# EAGLE design Fireball_v5.2_AB5SS (EAGLE 7.5.0)
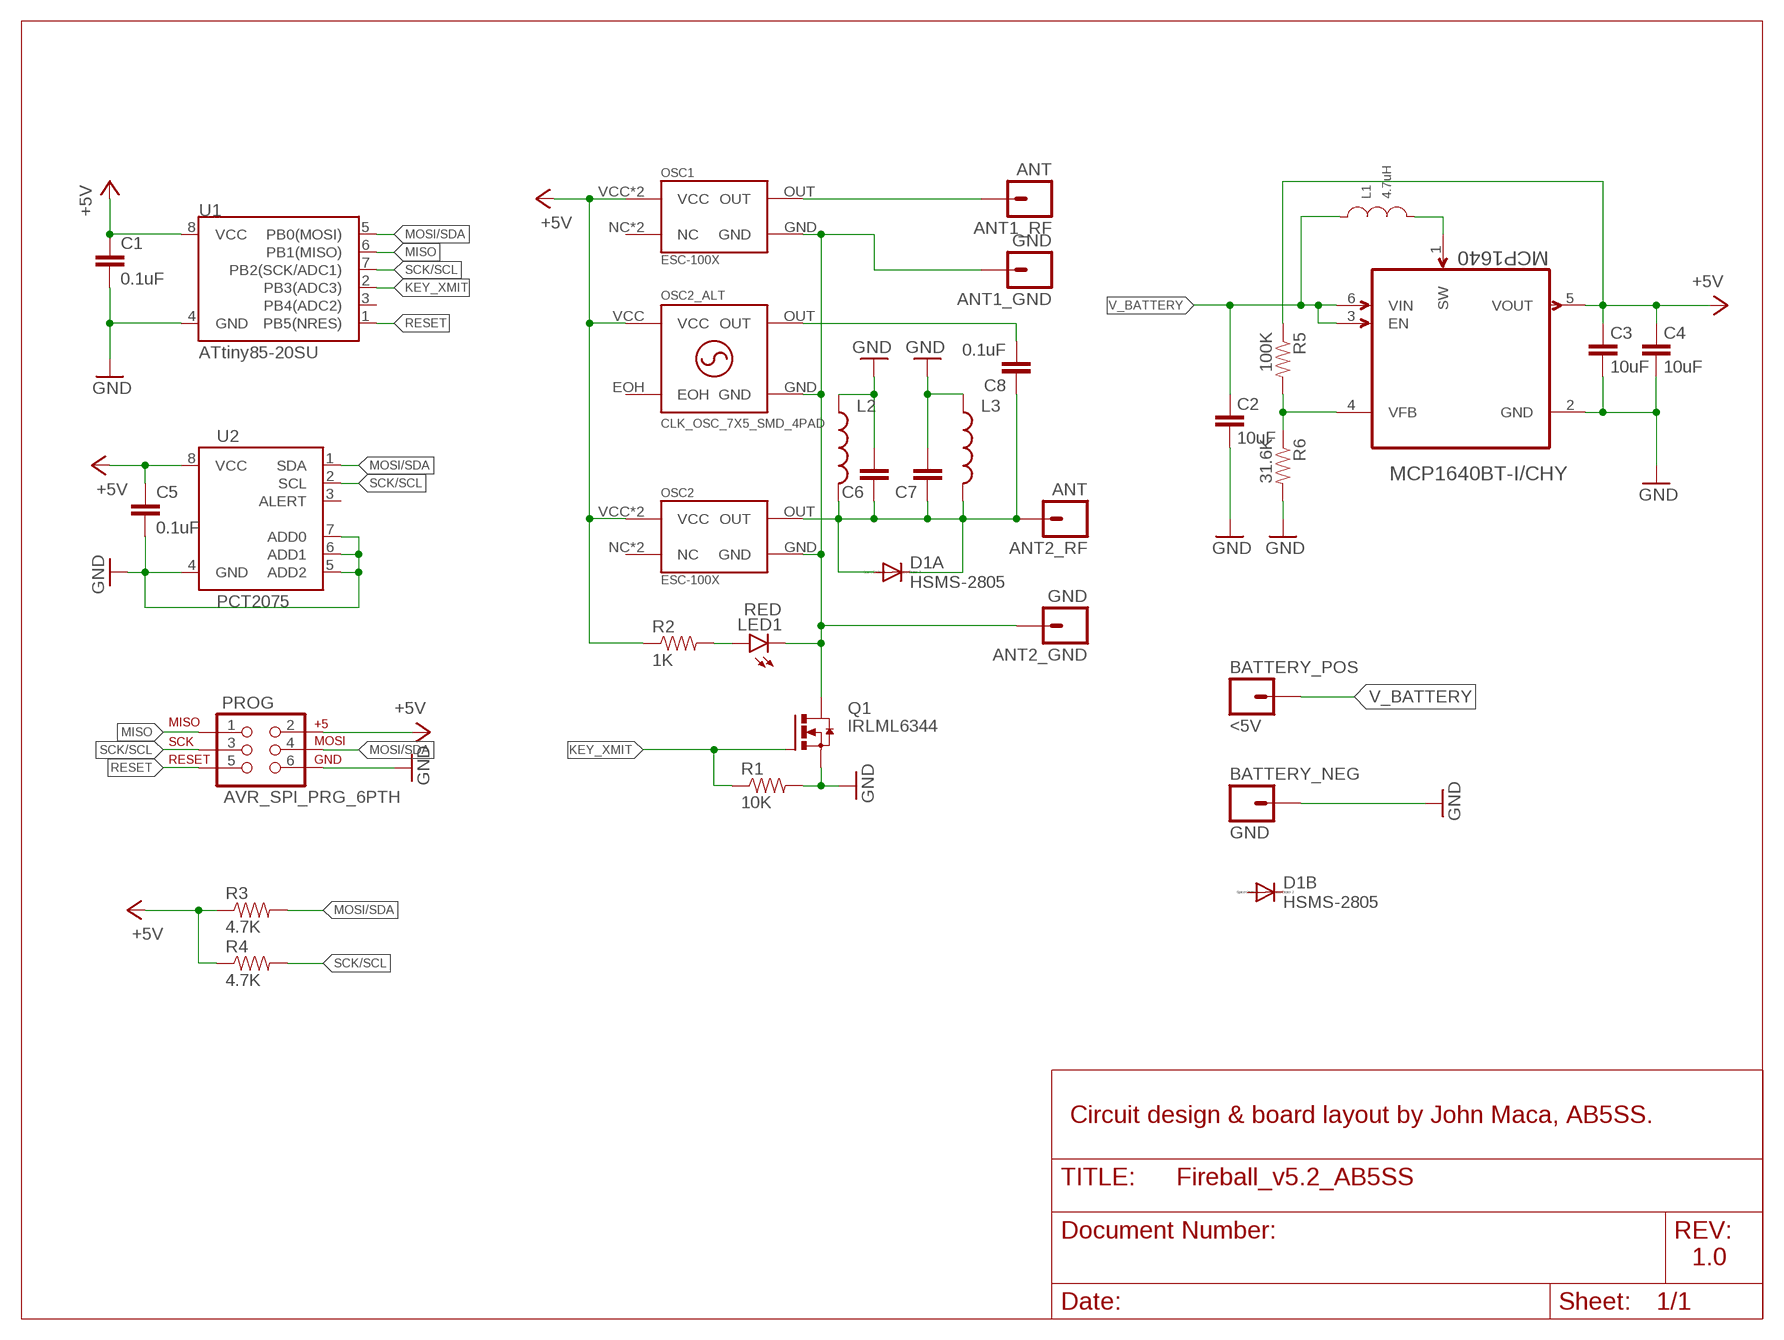
[diagram p0: schematic, sheet 1]

## Parts
ANT1_GND  GND  M01PTH_LONGPAD  [1X01_LONGPAD]
ANT1_RF  ANT  M01PTH_LONGPAD  [1X01_LONGPAD]
ANT2_GND  GND  M01PTH_LONGPAD  [1X01_LONGPAD]
ANT2_RF  ANT  M01PTH_LONGPAD  [1X01_LONGPAD]
BATTERY_NEG  GND  M01PTH_LONGPAD  [1X01_LONGPAD]
BATTERY_POS  <5V  M01PTH_LONGPAD  [1X01_LONGPAD]
C1  0.1uF  0.1UF-25V-5%(0603)  [0603-CAP]
C2  10uF  CAPACITOR_NPOL-0603  [C603]
C3  10uF  CAPACITOR_NPOL-0603  [C603]
C4  10uF  CAPACITOR_NPOL-0603  [C603]
C5  0.1uF  0.1UF-25V-5%(0603)  [0603-CAP]
C6  CAP0402-CAP  [0402-CAP]
C7  CAP0402-CAP  [0402-CAP]
C8  0.1uF  CAP0402-CAP  [0402-CAP]
D1  HSMS-2805  HSMS-2855  [SOT143_AVAGO]
L1  4.7uH  INDUCTOR-SRN4026  [SRN4026]
L2  INDUCTOR0402  [C0402]
L3  INDUCTOR0402  [C0402]
LED1  RED  LED0603  [LED-0603]
MCP1640  MCP1640BT-I/CHY  [SOT95P270X145-6N]
OSC1  ESC-100X  CLOCK_OSC_ECS-100X  [OSC-20.86X13.2-4PIN]
OSC2  ESC-100X  CLOCK_OSC_ECS-100X  [OSC-20.86X13.2-4PIN]
OSC2_ALT  CLK_OSC_7X5_SMD_4PAD  [CLK_OSC_7.00X5.00_SMD-4PAD]
PROG  AVR_SPI_PRG_6PTH  [2X3]
Q1  IRLML6344  [MICRO3]
R1  10K  10KOHM1/10W1%(0603)0603  [0603-RES]
R2  1K  1KOHM1/10W1%(0603)  [0603-RES]
R3  4.7K  1KOHM1/10W1%(0603)  [0603-RES]
R4  4.7K  1KOHM1/10W1%(0603)  [0603-RES]
R5  100K  1KOHM1/10W1%(0603)  [0603-RES]
R6  31.6K  1KOHM1/10W1%(0603)  [0603-RES]
U1  ATtiny85-20SU  ATTINY45TINY85-20-SMT  [SO08-EIAJ]
U2  PCT2075  LM75  [SO08]

## Nets
+5V: C1.1 C3.1 C4.1 C5.1 MCP1640.5(VOUT) OSC1.VCC OSC1.VCC2(VCC) OSC2.VCC OSC2.VCC2(VCC) OSC2_ALT.VCC PROG.2 R2.1 R3.1 R4.1 R5.1 U1.8(VCC) U2.8(VCC)
GND: BATTERY_NEG.1 C1.2 C2.2 C3.2 C4.2 C5.2 C6.2 C7.2 L2.1 L3.1 MCP1640.2(GND) PROG.6 Q1.2(S) R1.2 R6.2 U1.4(GND) U2.4(GND) U2.5(ADD2) U2.6(ADD1) U2.7(ADD0)
KEY_XMIT: Q1.1(G) R1.1 U1.2(PB3(ADC3))
L1_SW: L1.P$2 MCP1640.1(SW)
MISO: PROG.1 U1.6(PB1(MISO))
MOSI/SDA: PROG.4 R3.2 U1.5(PB0(MOSI)) U2.1(SDA)
N$1: ANT1_GND.1 ANT2_GND.1 LED1.C OSC1.GND OSC2.GND OSC2_ALT.GND Q1.3(D)
N$3: MCP1640.4(VFB) R5.2 R6.1
N$5: LED1.A R2.2
N$6: ANT1_RF.1 OSC1.OUT
N$7: ANT2_RF.1 C6.1 C7.1 C8.1 D1.1(A:C) D1.3(A:A) L2.2 L3.2 OSC2.OUT
N$8: C8.2 OSC2_ALT.OUT
RESET: PROG.5 U1.1(PB5(NRES))
SCK/SCL: PROG.3 R4.2 U1.7(PB2(SCK/ADC1)) U2.2(SCL)
V_BATTERY: BATTERY_POS.1 C2.1 L1.P$1 MCP1640.3(EN) MCP1640.6(VIN)
Unconnected: D1.2(B:C) D1.4(B:A) OSC1.NC OSC1.NC2(NC) OSC2.NC OSC2.NC2(NC) OSC2_ALT.EOH U1.3(PB4(ADC2)) U2.3(ALERT)

## Notes on the sheet
- Circuit design & board layout by John Maca, AB5SS.
- 1.0

## Library data of the parts
ANT1_GND ANT1_RF ANT2_GND ANT2_RF BATTERY_NEG BATTERY_POS = SparkFun-Connectors:M01: Header 1 Standard 1-pin 0.1" header. Use with straight break away headers (SKU : PRT-00116), right angle break away headers (PRT-00553), swiss pins (PRT-00743), machine pins (PRT-00117), and female headers (PRT-00115).
C1 C5 = SparkFun-Capacitors:0.1UF-25V-5%(0603): CAP-08604; PROD_ID: CAP-08604
C2-C4 = dp_devices:CAPACITOR_NPOL: Non-Polarized capacitor in various packages
C6-C8 = SparkFun-Passives:CAP: Capacitor Standard 0603 ceramic capacitor, and 0.1" leaded capacitor.
D1 = avago:HSMS-2855: Surface Mount Microwave Schottky Detector Diodes Source: Data sheet <http://www.farnell.com/datasheets/461166.pdf>
L1 = Bourns:INDUCTOR
L2 L3 = SparkFun-Passives:INDUCTOR: Inductors Basic Inductor/Choke - 0603 and 1206. Footprints are not proven and vary greatly between part numbers. SRN6045- 33uH, 20% 1.4A SDR0403-560KL - 56uH, 10%, 500mA RMS/740mA peak
LED1 = SparkFun-LED:LED: LEDs Standard schematic elements and footprints for 5mm, 3mm, 1206, and 0603 sized LEDs. 5mm - Spark Fun Electronics SKU : COM-00529 (and others)
MCP1640 = Microchip_By_element14_Batch_1:MCP1640BT-I/CHY: Synchronous Boost Regulator; MPN: MCP1640BT-I/CHY; OC_FARNELL: 1800207; OC_NEWARK: 73R3625; PACKAGE: SOT-6; SUPPLIER: Microchip
OSC1 OSC2 = SparkFun-FreqCtrl:CLOCK_OSC_ECS-100X: ECS-100X Clock Oscillator
OSC2_ALT = AB5SS:CLK_OSC_7X5_SMD_4PAD
PROG = SparkFun-Connectors:AVR_SPI_PRG_6: AVR ISP 6 Pin This is the reduced ISP connector for AVR programming. Common on Arduino. This footprint will take up less PCB space and can be used with a 10-pin to 6-pin adapter such as SKU: BOB-08508 **Special note about "TEST_POINT" package. The stop mask is on the top side, so if you want your programming test points to be on the bottom of your board, make sure to place this package on the bottom side of the board. This also ensure that the orientation to program from the bottom side will be correct.
Q1 = transistor-power:IRLML6344: HEXFET N-Channel Power MOSFET
R1 = SparkFun-Resistors:10KOHM1/10W1%(0603): RES-00824; PROD_ID: RES-00824
R2 = SparkFun-Resistors:1KOHM1/10W1%(0603): RES-07856; PROD_ID: RES-07856
R3-R6 = SparkFun-Resistors:1KOHM1/10W1%(0603): RES-07856; PROD_ID: RES-07856; VALUE: 1K
U1 = SparkFun-DigitalIC:ATTINY45: Atmel 8-pin 2/4/8kB flash uC; PROD_ID: IC-09092; VALUE: Tiny85-20-SMT
U2 = SparkFun-Sensors:LM75: LM75 Digital Temp Sensor www.ti.com

## Board
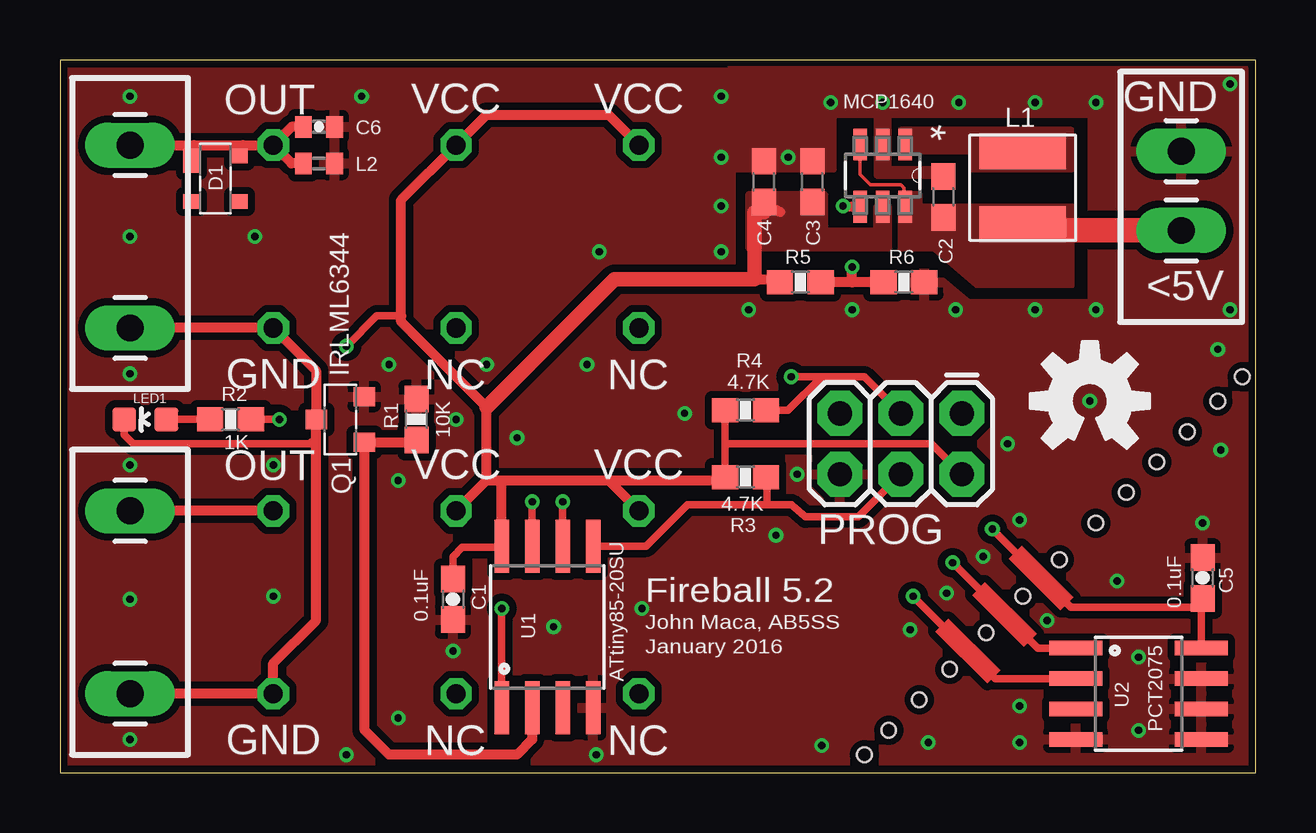
[diagram p1: board, top side]
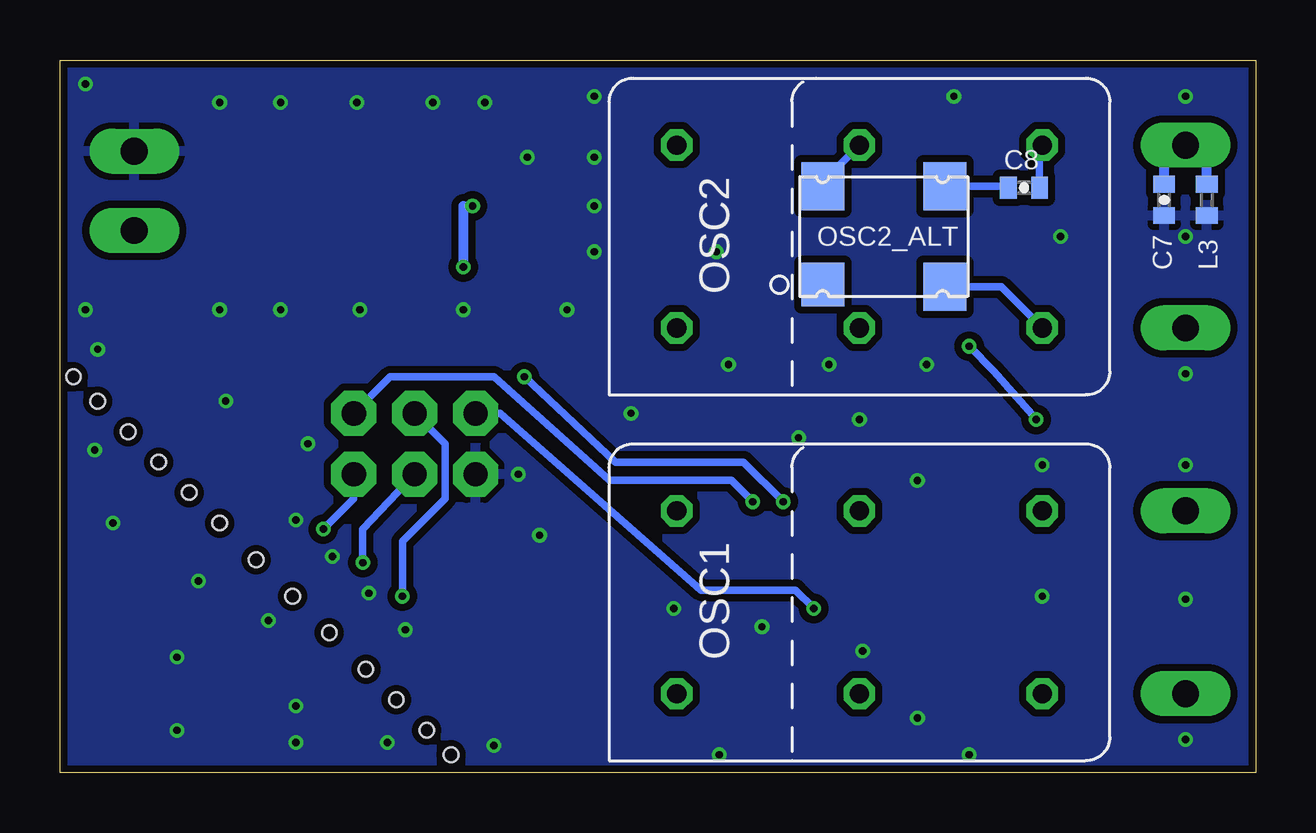
[diagram p2: board, bottom side, seen from below]

Size 49.84 x 29.71 mm. Coordinates in mm from the lower left corner, seen from the top.
Outline: 0,0 49.84,0 49.84,29.71 0,29.71 0,0
Copper layers (1*16): Top 0.035mm / dielectric 1.5mm / Bottom 0.035mm
Design rules "SeeedStudio_2layer_DRU_no_angle_20140221": minimum track width 6mil, minimum drill 12mil, track to track 6mil, track to pad 6mil, pad to pad 6mil, via to via 6mil, smd to smd 0mil, copper to edge 10mil, drill to drill 10mil, minimum pad ring 10mil, minimum via ring 6mil, stop-mask expansion 2mil, vias tented up to drill 100mil, thermal gap 10mil
Holes 0.6 mm at 41.66,8.89 43.18,10.41 44.45,11.68 45.72,12.95 46.99,14.22 48.26,15.49 49.28,16.51 40.13,7.37 38.61,5.84 37.08,4.32 35.81,3.05 34.54,1.78 33.53,0.76

### Footprints (pad centres in the part's own frame; a part is rotated, then mirrored left to right if it is on the bottom)
1X01_LONGPAD = drill 1.118 pad 1.88 long: 1 0,0
0603-CAP = smd 1.1 x 1: 1 -0.85,0; 2 0.85,0
C603 = smd 1.1 x 1: 1 -0.85,0; 2 0.85,0
0402-CAP = smd 0.7 x 0.9: 1 -0.65,0; 2 0.65,0
SOT143_AVAGO = smd 1 x 0.7: 1 -0.75,-1 | smd 0.6 x 0.7: 2 0.95,-1; 3 -0.95,1; 4 0.95,1
SRN4026 = smd 3.6 x 1.5: P$1 0,-1.525; P$2 0,1.525
C0402 = smd 0.7 x 0.9: 1 -0.65,0; 2 0.65,0
LED-0603 = smd 1 x 1: A 0,-0.877; C 0,0.877
SOT95P270X145-6N = smd 1.321 x 0.559: 1 -1.295,0.94; 2 -1.295,0; 3 -1.295,-0.94; 4 1.295,-0.94; 5 1.295,0; 6 1.295,0.94
OSC-20.86X13.2-4PIN = drill 0.8 octagon: GND 7.62,-3.81; NC -7.62,-3.81; NC2 0,-3.81; OUT 7.62,3.81; VCC -7.62,3.81; VCC2 0,3.81
CLK_OSC_7.00X5.00_SMD-4PAD = smd 1.8 x 1.8: EOH -2.54,-2 | smd 1.8 x 2: GND 2.54,-2.1; OUT 2.54,2.1; VCC -2.54,2.1
2X3 = drill 1.016 pad 1.88 octagon: 1 0,0; 2 0,2.54; 3 2.54,0; 4 2.54,2.54; 5 5.08,0; 6 5.08,2.54
MICRO3 = smd 0.8 x 0.9: 1 -0.95,-1; 2 0.95,-1; 3 0,1
0603-RES = smd 1.1 x 1: 1 -0.85,0; 2 0.85,0
SO08-EIAJ = smd 0.61 x 2.21: 1 -1.905,-3.378; 2 -0.635,-3.378; 3 0.635,-3.378; 4 1.905,-3.378; 5 1.905,3.353; 6 0.635,3.353; 7 -0.635,3.353; 8 -1.905,3.353
SO08 = smd 0.61 x 2.21: 1 -1.905,-2.616; 2 -0.635,-2.616; 3 0.635,-2.616; 4 1.905,-2.616; 5 1.905,2.616; 6 0.635,2.616; 7 -0.635,2.616; 8 -1.905,2.616

### Placement (x,y rotation side)
ANT1_GND  2.92,3.3 270 top
ANT1_RF  2.92,10.92 270 top
ANT2_GND  2.92,18.54 270 top
ANT2_RF  2.92,26.16 270 top
BATTERY_NEG  46.74,25.91 90 top
BATTERY_POS  46.74,22.61 90 top
C1  16.38,7.24 270 top
C2  36.83,24 90 top
C3  31.37,24.64 90 top
C4  29.34,24.64 90 top
C5  47.62,8.13 90 top
C6  10.79,26.92 0 top
C7  3.81,23.88 270 bottom
C8  9.65,24.38 180 bottom
D1  6.48,24.77 270 top
L1  40.13,24.38 0 top
L2  10.79,25.4 180 top
L3  2.03,23.88 90 bottom
LED1  3.56,14.73 90 top
MCP1640  34.29,24.89 270 top
OSC1  16.51,7.11 0 bottom
OSC2  16.51,22.35 0 bottom
OSC2_ALT  15.49,22.35 0 bottom
PROG  37.59,14.99 180 top
Q1  11.68,14.73 90 top
R1  14.86,14.73 90 top
R2  7.11,14.73 180 top
R3  28.57,12.32 0 top
R4  28.57,15.11 0 top
R5  30.86,20.45 0 top
R6  35.18,20.45 0 top
U1  20.32,6.1 0 top
U2  44.96,3.3 270 top
U$1  [OSHW-LOGO-M]  42.93,15.49 0 top

### Tracks (layer width: path | path; a pad name or v marks a point on that pad's centre or on a via)
+5V  (via drill 0.3, 0.3 pad 0.3)
  Top 0.305: C1.1 16.38,9.02 16.76,9.4 18.11,9.4 U1.8 | R2.1 v9.14,14.73 | v11.94,17.78 13.21,19.05 14.22,19.05 | R3.1 27.73,13.72 | 27.73,13.72 R4.1 | PROG.2 36.32,13.72 27.73,13.72 | 47.59,5.22 U2.8 47.57,7.28 C5.1 47.62,6.9 42.12,6.9 v38.86,10.16
  Top 0.406: OSC2.VCC 22.86,27.43 17.78,27.43 OSC2.VCC2 14.22,23.88 14.22,19.05 14.22,18.8 17.78,15.24 17.78,12.19 | OSC1.VCC2 17.78,12.19 | 17.78,12.19 18.29,12.19 | 18.29,12.19 22.86,12.19 | 22.86,12.19 OSC1.VCC | U1.8 18.41,12.06 18.29,12.19 | 30.01,23.37 C4.1 | 22.86,12.19 27.73,12.19 R3.1 | 28.96,20.57 30.01,20.57 R5.1
  Top 0.61: 17.78,15.24 23.11,20.57 28.96,20.57 28.96,23.37 29.34,23.37 C4.1
  Bottom 0.305: v9.14,14.73 10.92,16.76 v11.94,17.78 | 37.21,12.83 PROG.2 37.59,11.43 v38.86,10.16 | OSC2_ALT.VCC 18.03,24.64 OSC2.VCC2
  pour Top (no thermals): 28.7,24.13 31.88,24.13 31.88,22.61 34.04,22.61 34.04,23.62 34.54,23.62 34.54,21.84 28.7,21.84
GND  (via drill 0.3 pad 0.25)
  other vias: 30.73,12.45 27.56,25.65 43.18,19.3 22.35,0.76 11.94,0.76 20.57,6.1 16.38,5.08 39.5,13.72 40.01,2.79 44.96,4.83 44.96,1.78 47.62,10.41 2.92,28.19 2.92,12.83 2.92,1.4 43.18,27.94 8.13,22.35 8.89,7.37 42.93,15.49 48.77,28.7 48.77,19.3 38.48,9.02 36.96,7.49 35.43,5.97 40.01,10.54 37.47,27.94 37.34,19.3 34.29,27.94 17.78,17.02 41.15,6.35 44.07,8 31.75,1.14 48.39,13.46 36.2,1.27 19.05,13.97 27.56,21.72 30.35,25.65 13.72,17.02 2.92,16.64 12.57,28.19 2.92,22.35 24.26,6.86 2.92,7.24 16.51,14.73 40.01,1.27 48.26,17.65 28.7,19.3 27.56,23.62 33.02,19.3 40.64,19.3 40.64,27.94 32.13,27.94 27.56,28.19 22.48,21.72 14.1,2.29 14.1,12.19 26.04,14.99 21.97,17.02 29.84,9.91 8.89,12.83
  pour Bottom (isolate 0.305): -2.54,33.02 -2.54,-1.27 53.34,-1.27 53.34,33.02
  pour Top (isolate 0.305): -3.81,32.26 28.07,32.13 27.94,26.16 27.94,20.83 36.32,20.83 37.85,19.56 43.05,19.56 43.05,31.5 51.82,31.75 51.82,17.27 52.07,-1.27 -3.81,-1.27
  pour Top (no thermals): 34.04,27.43 34.04,24.89 37.08,24.89 37.08,25.15 34.54,25.15 34.54,27.43 49.4,27.43 49.4,29.46 27.94,29.46 27.94,25.15 32.26,25.15 32.26,27.43
KEY_XMIT
  Top 0.406: R1.1 14.76,13.78 Q1.1 12.7,13.77 12.7,1.78 13.72,0.76 19.05,0.76 19.68,1.4 U1.2
L1_SW
  pour Top (no thermals): 35.05,25.91 37.97,25.91 37.97,25.15 42.16,25.15 42.16,26.8 35.05,26.8
MISO  (via drill 0.3 pad 0.3)
  Top 0.305: v20.95,11.3 U1.6
  Bottom 0.305: PROG.1 36.07,16.51 31.75,16.51 26.92,12.19 21.84,12.19 v20.95,11.3
MOSI/SDA  (via drill 0.3 pad 0.3)
  Top 0.305: U2.1 40.77,5.21 v37.21,8.76 | PROG.4 33.27,10.67 31.08,10.67 30.48,11.18 29.46,11.18 | U1.5 24.43,9.45 26.16,11.18 29.46,11.18 | R3.2 29.46,12.32 29.46,11.18
  Bottom 0.305: v37.21,8.76 37.21,10.16 PROG.4
N$1
  Top 0.305: LED1.C 2.68,14.09 3.05,13.72 10.41,13.72 10.67,13.97
  Top 0.406: ANT1_GND.1 OSC1.GND 8.89,4.57 10.67,6.35 10.67,13.97 10.67,14.72 Q1.3 10.67,14.75 10.67,16.76 OSC2.GND ANT2_GND.1
  Bottom 0.305: OSC2_ALT.GND 10.6,20.25 OSC2.GND
N$3  (via drill 0.3)
  Top 0.406: 33.02,20.45 v33.02,21.08 | v32.64,23.62 33.02,23.6 MCP1640.4 | 32.09,20.32 R5.2 33.02,20.45 | R6.1 33.02,20.45
  Bottom 0.406: v33.02,21.08 33.02,23.62 v32.64,23.62
N$5
  Top 0.305: LED1.A R2.2
N$6
  Top 0.406: OSC1.OUT ANT1_RF.1
N$7
  Top 0.406: ANT2_RF.1 5.59,26.16 | 5.59,26.16 7.62,26.16 | 7.62,26.16 OSC2.OUT | D1.3 7.62,25.71 7.62,26.16 | D1.1 5.59,25.52 5.59,26.16 | C6.1 9.65,26.92 OSC2.OUT | L2.2 9.65,25.4 OSC2.OUT
  Bottom 0.305: C8.1 9,26.05 OSC2.OUT
  Bottom 0.406: L3.2 2.03,25.53 ANT2_RF.1 3.81,25.53 C7.1
N$8
  Bottom 0.305: OSC2_ALT.OUT 10.37,24.45 C8.2
RESET  (via drill 0.3 pad 0.3)
  Top 0.305: v18.41,6.86 U1.1
  Bottom 0.305: PROG.5 31.5,14.99 23.11,7.62 19.18,7.62 v18.41,6.86
SCK/SCL  (via drill 0.3 pad 0.3)
  Top 0.305: U2.2 38.99,3.94 v35.56,7.37 | R4.2 30.35,15.11 31.75,16.51 | 31.75,16.51 33.53,16.51 PROG.3 | U1.7 v19.68,11.3 | v30.48,16.51 31.75,16.51
  Bottom 0.305: v35.56,7.37 35.56,9.65 33.78,11.43 33.78,13.72 PROG.3 | v19.68,11.3 21.34,12.95 26.67,12.95 v30.48,16.51
V_BATTERY
  Top 0.152: MCP1640.3 33.35,24.94 33.78,24.51 35.05,24.51 35.18,24.38 35.18,23.65 MCP1640.6
  Top 1.016: BATTERY_POS.1 41.15,22.61 L1.P$1
  pour Top (no thermals): 35.05,24.13 35.81,24.13 35.81,23.62 42.16,23.62 42.16,20.32 38.23,20.32 36.45,21.84 35.05,21.84
(copper drawn outside any net)
  shapes: Top area x3

### Text on the board
tNames: Fireball 5.2 | John Maca, AB5SS | January 2016